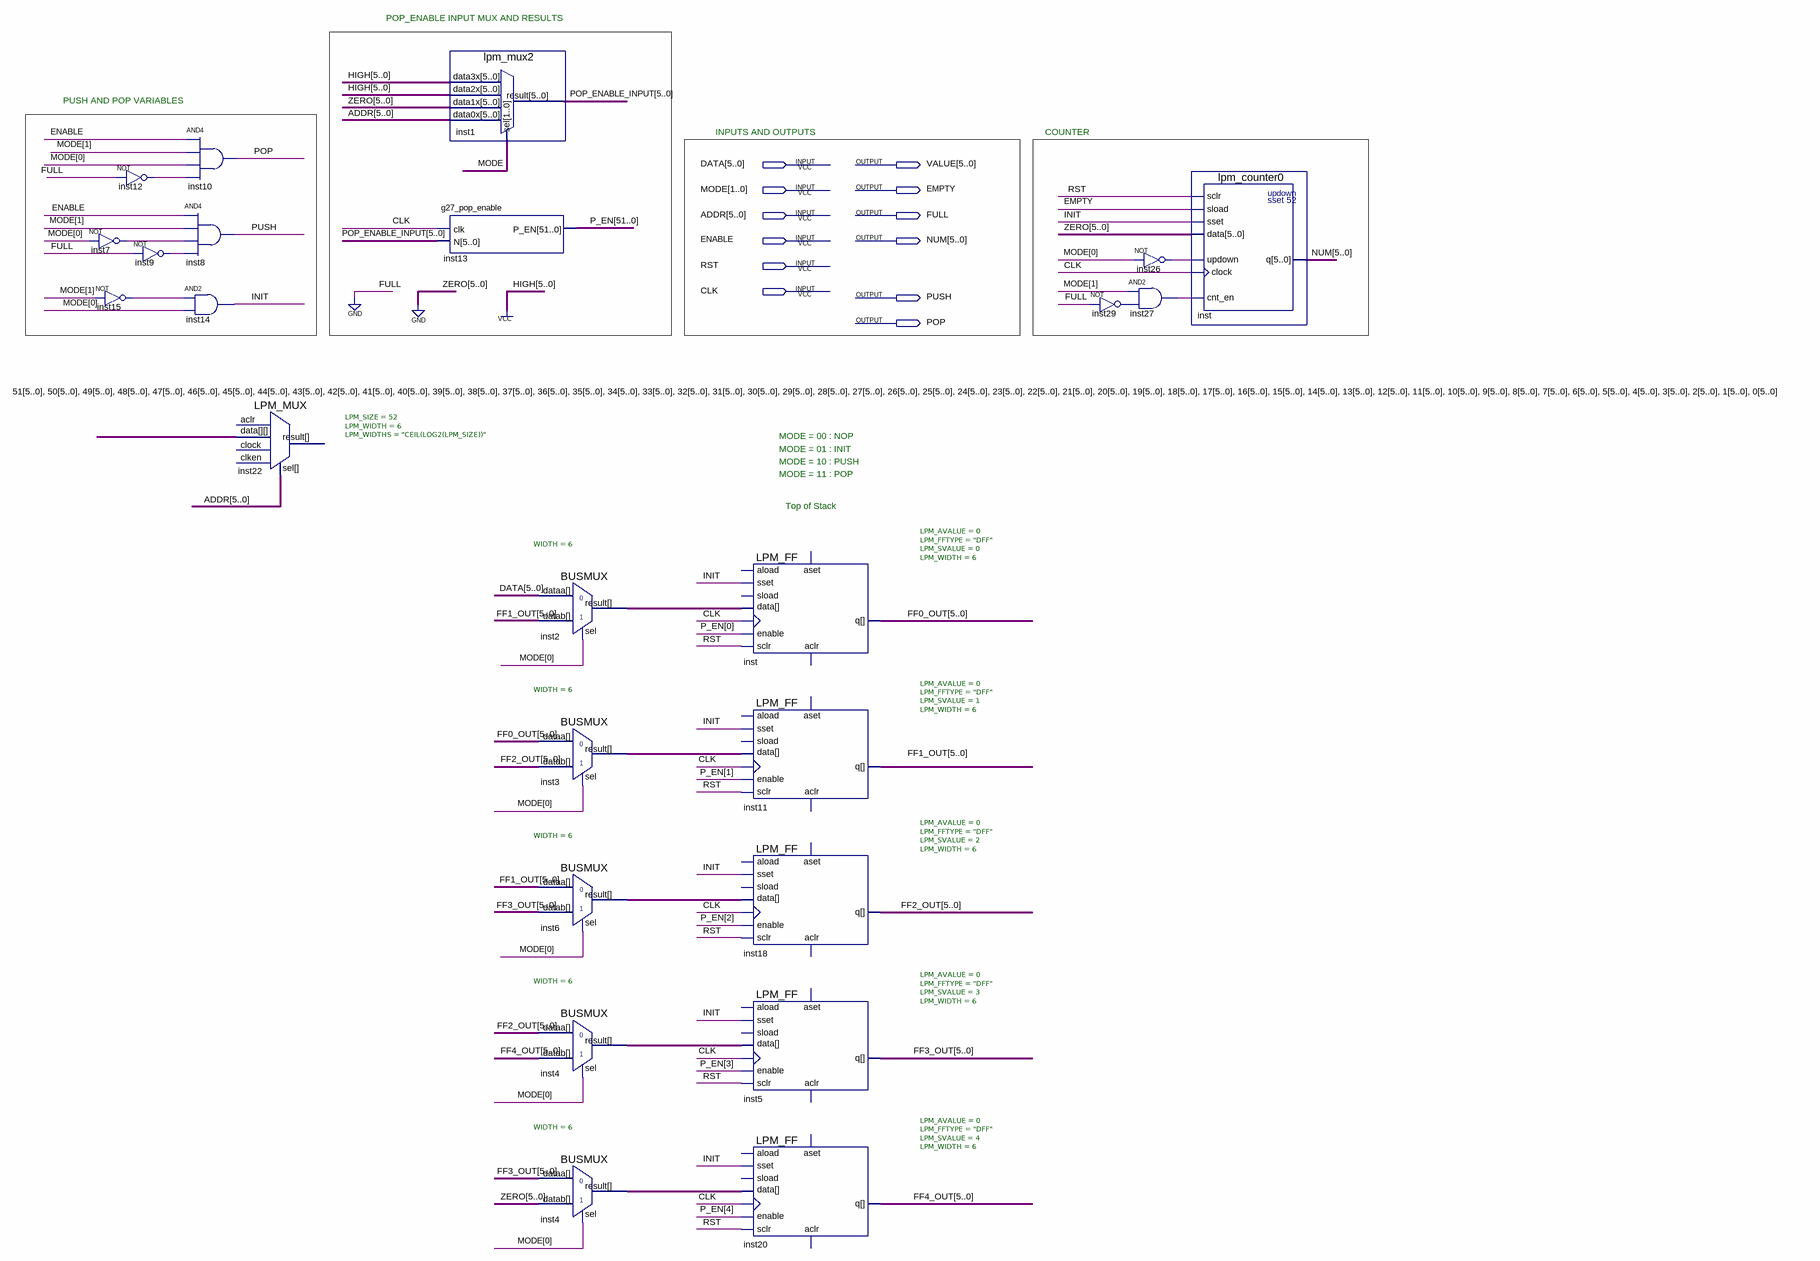
[diagram p0: schematic sheet]
// Quartus schematic g27_stack52 - Copy.bdf as structural Verilog: 24 symbols, 12 pins
module \g27_stack52_-_Copy  (
  input  [5:0] DATA,
  input  [1:0] MODE,
  input  [5:0] ADDR,
  input  ENABLE,
  input  RST,
  input  CLK,
  output [5:0] VALUE,
  output EMPTY,
  output FULL,
  output [5:0] NUM,
  output PUSH,
  output POP
);

  wire INIT, inst7_out, inst9_out, inst12_out, inst15_out, inst26_out, inst27_out, inst29_out, MODE_1bit;
  wire [5:0] \0 , \1 , \2 , \3 , \4 , \5 , \6 , \7 , \8 , \9 , \10 , \11 , \12 , \13 , \14 , \15 , \16 ,
       \17 , \18 , \19 , \20 , \21 , \22 , \23 , \24 , \25 , \26 , \27 , \28 , \29 , \30 , \31 , \32 , \33 ,
       \34 , \35 , \36 , \37 , \38 , \39 , \40 , \41 , \42 , \43 , \44 , \45 , \46 , \47 , \48 , \49 , \50 ,
       \51 , FF0_OUT, FF1_OUT, FF2_OUT, FF3_OUT, FF4_OUT, inst2_result, inst3_result, inst4_result,
       inst4_result_2, inst6_result, POP_ENABLE_INPUT;
  wire [51:0] P_EN;

  not inst12 (inst12_out, 1'b0);
  not inst7 (inst7_out, MODE[0]);
  not inst15 (inst15_out, MODE[1]);
  not inst9 (inst9_out, 1'b0);
  and inst10 (POP, ENABLE, MODE[1], MODE[0], inst12_out);
  and inst8 (PUSH, ENABLE, MODE[1], inst7_out, inst9_out);
  and inst14 (INIT, inst15_out, MODE[0]);
  LPM_MUX #(.LPM_SIZE(52), .LPM_WIDTH(6), .LPM_WIDTHS("CEIL(LOG2(LPM_SIZE))")) inst22 (
    .data({\51 , \50 , \49 , \48 , \47 , \46 , \45 , \44 , \43 , \42 , \41 , \40 , \39 , \38 , \37 , \36 , \35 , \34 , \33 , \32 , \31 , \30 , \29 , \28 , \27 , \26 , \25 , \24 , \23 , \22 , \21 , \20 , \19 , \18 , \17 , \16 , \15 , \14 , \13 , \12 , \11 , \10 , \9 , \8 , \7 , \6 , \5 , \4 , \3 , \2 , \1 , \0 }),
    .sel(ADDR));  // open: clock, aclr, clken, result
  lpm_mux2 inst1 (
    .data3x({6{1'b1}}), .data2x({6{1'b1}}), .data1x({6{1'b0}}), .data0x(ADDR), .sel({2{MODE_1bit}}),
    .result(POP_ENABLE_INPUT));
  g27_pop_enable inst13 (.clk(CLK), .N(POP_ENABLE_INPUT), .P_EN(P_EN));
  BUSMUX #(.WIDTH(6)) inst2 (.datab(FF1_OUT), .sel(MODE[0]), .dataa(DATA), .result(inst2_result));
  BUSMUX #(.WIDTH(6)) inst3 (.datab(FF2_OUT), .sel(MODE[0]), .dataa(FF0_OUT), .result(inst3_result));
  BUSMUX #(.WIDTH(6)) inst6 (.datab(FF3_OUT), .sel(MODE[0]), .dataa(FF1_OUT), .result(inst6_result));
  BUSMUX #(.WIDTH(6)) inst4 (.datab(FF4_OUT), .sel(MODE[0]), .dataa(FF2_OUT), .result(inst4_result));
  BUSMUX #(.WIDTH(6)) inst4_dup2 (.datab({6{1'b0}}), .sel(MODE[0]), .dataa(FF3_OUT), .result(inst4_result_2));
  LPM_FF #(.LPM_AVALUE(0), .LPM_FFTYPE("DFF"), .LPM_SVALUE(0), .LPM_WIDTH(6)) inst (
    .enable(P_EN[0]), .clock(CLK), .sset(INIT), .sclr(RST), .data(inst2_result), .q(FF0_OUT));  // open: aload, sload, aset, aclr
  LPM_FF #(.LPM_AVALUE(0), .LPM_FFTYPE("DFF"), .LPM_SVALUE(1), .LPM_WIDTH(6)) inst11 (
    .enable(P_EN[1]), .clock(CLK), .sset(INIT), .sclr(RST), .data(inst3_result), .q(FF1_OUT));  // open: aload, sload, aset, aclr
  LPM_FF #(.LPM_AVALUE(0), .LPM_FFTYPE("DFF"), .LPM_SVALUE(2), .LPM_WIDTH(6)) inst18 (
    .enable(P_EN[2]), .clock(CLK), .sset(INIT), .sclr(RST), .data(inst6_result), .q(FF2_OUT));  // open: aload, sload, aset, aclr
  LPM_FF #(.LPM_AVALUE(0), .LPM_FFTYPE("DFF"), .LPM_SVALUE(3), .LPM_WIDTH(6)) inst5 (
    .enable(P_EN[3]), .clock(CLK), .sset(INIT), .sclr(RST), .data(inst4_result), .q(FF3_OUT));  // open: aload, sload, aset, aclr
  LPM_FF #(.LPM_AVALUE(0), .LPM_FFTYPE("DFF"), .LPM_SVALUE(4), .LPM_WIDTH(6)) inst20 (
    .enable(P_EN[4]), .clock(CLK), .sset(INIT), .sclr(RST), .data(inst4_result_2), .q(FF4_OUT));  // open: aload, sload, aset, aclr
  not inst26 (inst26_out, MODE[0]);
  and inst27 (inst27_out, MODE[1], inst29_out);
  not inst29 (inst29_out, 1'b0);
  lpm_counter0 inst_dup2 (
    .sclr(RST), .sload(EMPTY), .data({6{1'b0}}), .sset(INIT), .updown(inst26_out), .clock(CLK),
    .cnt_en(inst27_out), .q(NUM));

  assign FULL = 1'b0;

  // Notes on the sheet:
  //   POP_ENABLE INPUT MUX AND RESULTS
  //   PUSH AND POP VARIABLES
  //   INPUTS AND OUTPUTS
  //   COUNTER
  //   MODE = 00 : NOP
  //   MODE = 01 : INIT
  //   MODE = 10 : PUSH
  //   MODE = 11 : POP
  //   Top of Stack
endmodule
